# EAGLE schematic Untitled (EAGLE 7.2.0)
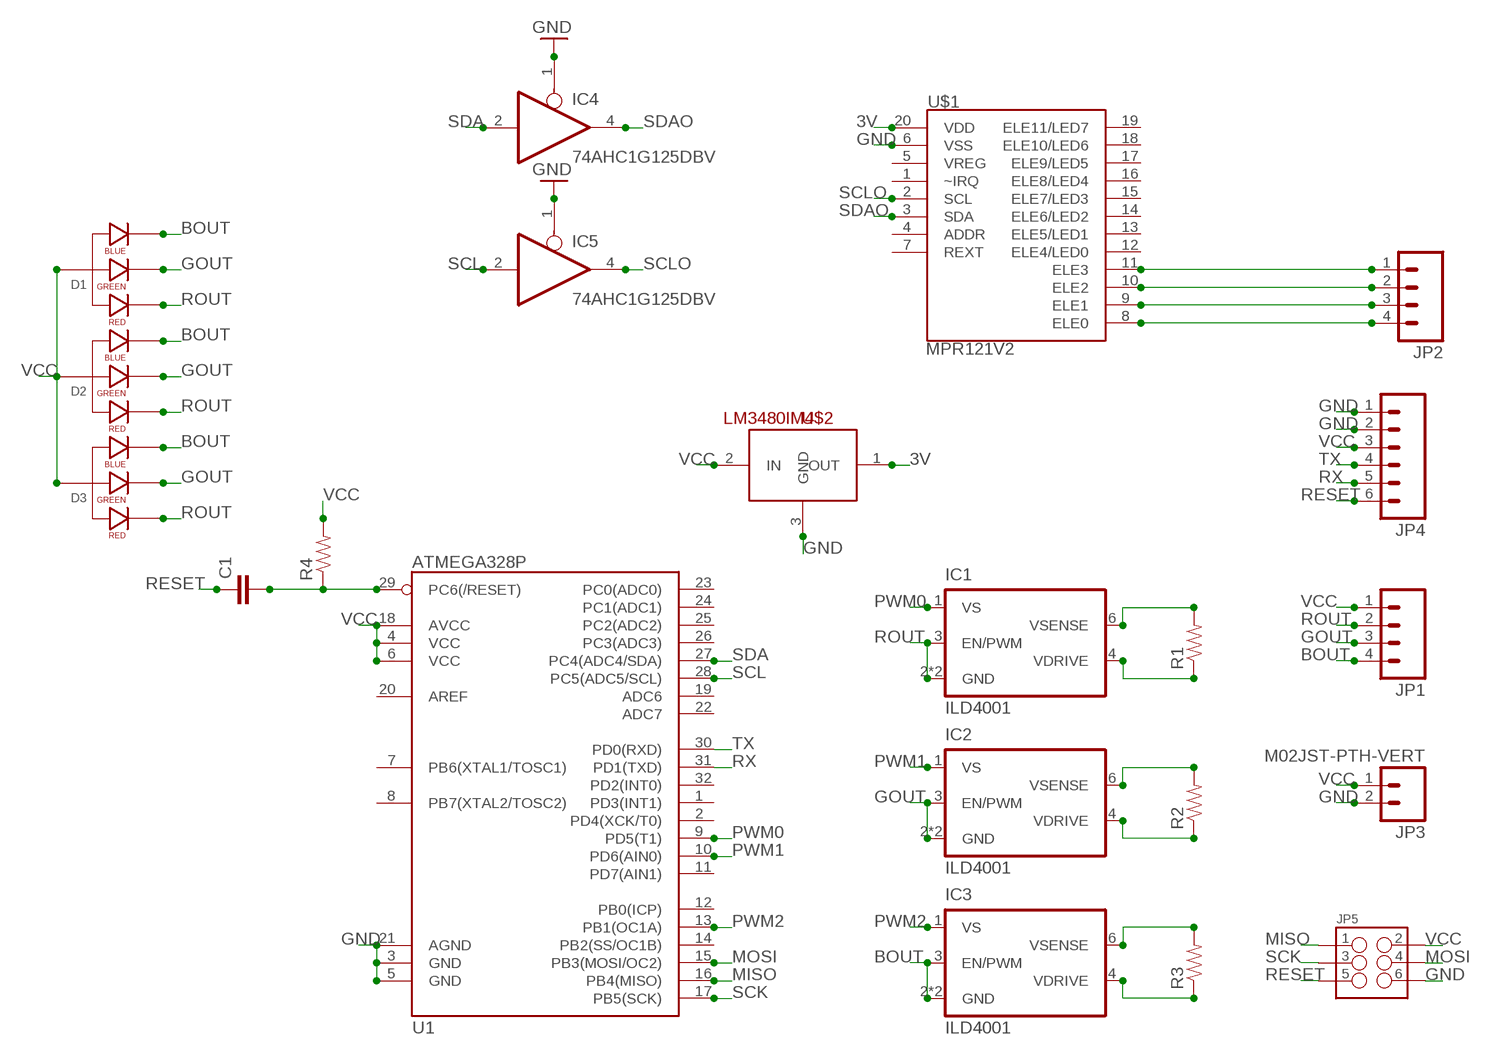
[diagram p0: schematic, sheet 1]

## Parts
C1  CAP0805  [0805]
D1  LED-RGB-CA-THRUCLEAR  [LED-RGB-THRU]
D2  LED-RGB-CA-THRUCLEAR  [LED-RGB-THRU]
D3  LED-RGB-CA-THRUCLEAR  [LED-RGB-THRU]
IC1  ILD4001  [SC74_INFINEON]
IC2  ILD4001  [SC74_INFINEON]
IC3  ILD4001  [SC74_INFINEON]
IC4  74AHC1G125DBV  [SOT23-5]
IC5  74AHC1G125DBV  [SOT23-5]
JP1  M04JST-PTH-VERT  [JST-4-PTH-VERT]
JP2  M04JST-PTH-VERT  [JST-4-PTH-VERT]
JP3  M02JST-PTH-VERT  [JST-2-PTH-VERT]
JP4  M06LONGPADS  [1X06_LONGPADS]
JP5  M03X22X3_SILK_MALE_PTH  [2X3]
R1  RESISTOR0805-RES  [0805]
R2  RESISTOR0805-RES  [0805]
R3  RESISTOR0805-RES  [0805]
R4  RESISTOR0805-RES  [0805]
U1  ATMEGA328P  ATMEGA328_SMT  [TQFP32-08]
U$1  MPR121V2  [QFN-20-0.4MM-V2]
U$2  LM3480IM4  [SOT23-3]

## Nets
3V: U$1.20(VDD) U$2.1(OUT)
BOUT: D1.4(BLUE_CATHODE) D2.4(BLUE_CATHODE) D3.4(BLUE_CATHODE) IC3.2(GND) IC3.3(EN/PWM) IC3.5(GND) JP1.4
GND: IC4.1(OE) IC5.1(OE) JP3.2 JP4.1 JP4.2 JP5.6 U1.3(GND) U1.5(GND) U1.21(AGND) U$1.6(VSS) U$2.3(GND)
GOUT: D1.3(GREEN_CATHODE) D2.3(GREEN_CATHODE) D3.3(GREEN_CATHODE) IC2.2(GND) IC2.3(EN/PWM) IC2.5(GND) JP1.3
MISO: JP5.1 U1.16(PB4(MISO))
MOSI: JP5.4 U1.15(PB3(MOSI/OC2))
N$1: JP2.1 U$1.11(ELE3)
N$2: JP2.2 U$1.10(ELE2)
N$3: JP2.3 U$1.9(ELE1)
N$4: JP2.4 U$1.8(ELE0)
N$5: C1.2 R4.1 U1.29(PC6(/RESET))
N$7: IC1.6(VSENSE) R1.2
N$8: IC1.4(VDRIVE) R1.1
N$9: IC2.6(VSENSE) R2.2
N$10: IC2.4(VDRIVE) R2.1
N$11: IC3.6(VSENSE) R3.2
N$12: IC3.4(VDRIVE) R3.1
PWM0: IC1.1(VS) U1.9(PD5(T1))
PWM1: IC2.1(VS) U1.10(PD6(AIN0))
PWM2: IC3.1(VS) U1.13(PB1(OC1A))
RESET: C1.1 JP4.6 JP5.5
ROUT: D1.1(RED_CATHODE) D2.1(RED_CATHODE) D3.1(RED_CATHODE) IC1.2(GND) IC1.3(EN/PWM) IC1.5(GND) JP1.2
RX: JP4.5 U1.31(PD1(TXD))
SCK: JP5.3 U1.17(PB5(SCK))
SCL: IC5.2(I) U1.28(PC5(ADC5/SCL))
SCLO: IC5.4(O) U$1.2(SCL)
SDA: IC4.2(I) U1.27(PC4(ADC4/SDA))
SDAO: IC4.4(O) U$1.3(SDA)
TX: JP4.4 U1.30(PD0(RXD))
VCC: D1.2(ANODE) D2.2(ANODE) D3.2(ANODE) JP1.1 JP3.1 JP4.3 JP5.2 R4.2 U1.4(VCC) U1.6(VCC) U1.18(AVCC) U$2.2(IN)
Unconnected: U1.1(PD3(INT1)) U1.2(PD4(XCK/T0)) U1.7(PB6(XTAL1/TOSC1)) U1.8(PB7(XTAL2/TOSC2)) U1.11(PD7(AIN1)) U1.12(PB0(ICP)) U1.14(PB2(SS/OC1B)) U1.19(ADC6) U1.20(AREF) U1.22(ADC7) U1.23(PC0(ADC0)) U1.24(PC1(ADC1)) U1.25(PC2(ADC2)) U1.26(PC3(ADC3)) U1.32(PD2(INT0)) U$1.1(~IRQ) U$1.4(ADDR) U$1.5(VREG) U$1.7(REXT) U$1.12(ELE4/LED0) U$1.13(ELE5/LED1) U$1.14(ELE6/LED2) U$1.15(ELE7/LED3) U$1.16(ELE8/LED4) U$1.17(ELE9/LED5) U$1.18(ELE10/LED6) U$1.19(ELE11/LED7)

## Power pins joined to a net without a drawn wire
GND: IC4.3(GND) IC5.3(GND)
VCC: IC4.5(VCC) IC5.5(VCC)

## Library data of the parts
C1 = SparkFun-Capacitors:CAP: Capacitor Standard 0603 ceramic capacitor, and 0.1" leaded capacitor.
D1-D3 = SparkFun-LED:LED-RGB-CA-THRU: RGB Through-hole common anode SparkFun store front COM-10821 (diffuse) COM-10820 (clear); PROD_ID: DIO-10631
IC1-IC3 = infineon:ILD4001: LED Driver for High Power LEDs Source: http://www.infineon.com/dgdl/ILD4001-Step-down-LED-Controller-Rev2.0.pdf?folderId=db3a30431f848401011fcbf2ab4c04c4&fileId=db3a30433072cd8f01308fc1af03786b
IC4 IC5 = 74xx-little-us:74*1G125: Single Bus Buffer Gate with 3-State Output
JP1 JP2 = SparkFun-Connectors:M04: Header 4 Standard 4-pin 0.1" header. Use with straight break away headers (SKU : PRT-00116), right angle break away headers (PRT-00553), swiss pins (PRT-00743), machine pins (PRT-00117), and female headers (PRT-00115). Molex polarized connector foot print use with SKU : PRT-08231 with associated crimp pins and housings. 1MM SMD Version SKU: PRT-10208
JP3 = SparkFun-Connectors:M02: Standard 2-pin 0.1" header. Use with - straight break away headers ( PRT-00116) - right angle break away headers (PRT-00553) - swiss pins (PRT-00743) - machine pins (PRT-00117) - female headers (PRT-00115) Molex polarized connector foot print use with: PRT-08233 with associated crimp pins and housings. 2.54_SCREWTERM for use with PRT-10571. 3.5mm Screw Terminal footprints for PRT-08084 5mm Screw Terminal footprints for use with PRT-08432
JP4 = SparkFun-Connectors:M06: Header 6 Standard 6-pin 0.1" header. Use with straight break away headers (SKU : PRT-00116), right angle break away headers (PRT-00553), swiss pins (PRT-00743), machine pins (PRT-00117), and female headers (PRT-00115). Molex polarized connector foot print use with SKU : PRT-08094 with associated crimp pins and housings. NOTES ON THE VARIANTS LOCK and LOCK_LONGPADS... This footprint was designed to help hold the alignment of a through-hole component (i.e. 6-pin header) while soldering it into place. You may notice that each hole has been shifted either up or down by 0.005 of an inch from it's more standard position (which is a perfectly straight line). This slight alteration caused the pins (the squares in the middle) to touch the edges of the holes. Because they are alternating, it causes a "brace" to hold the component in place. 0.005 has proven to be the perfect amount of "off-center" position when using our standard breakaway headers. Although looks a little odd when you look at the bare footprint, once you have a header in there, the alteration is very hard to notice. Also,if you push a header all the way into place, it is covered up entirely on the bottom side. This idea of altering the position of holes to aid alignment will be further integrated into the Sparkfun Library for other footprints. It can help hold any component with 3 or more connection pins.
JP5 = SparkFun-Connectors:M03X2: 2x3 .1" header. Shrouded, with keying- CONN-10681 SMT- CONN-11415 Pogo pins- HW-11044; PROD_ID: CONN-09701
R1-R4 = SparkFun-Resistors:RESISTOR: Resistor Basic schematic elements and footprints for 0603, 1206, and PTH resistors.
U1 = SparkFun-DigitalIC:ATMEGA328_SMT: 32-Pin Atmega328 part Commonly used on Arduino compatible boards Available in QFP and QFN packages TQFP is IC-09069 QFN is non-stock; PROD_ID: IC-09069
U$1 = SparkFun-Sensors:MPR121: MPR121 Capacitive Touch Sensor Controller. Variant "V2" was created using an image import of the bottom of the IC. It matches metal to metal.
U$2 = SparkFun-PowerIC:LM3480IM4: Small package linear regulator